# EAGLE design single_peg_board (EAGLE 9.3.0)
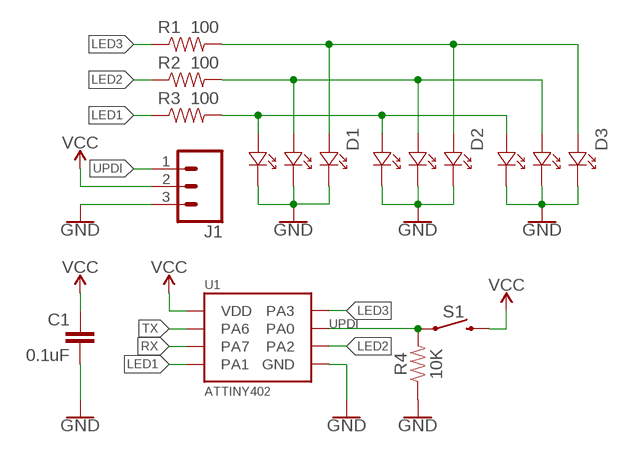
[diagram p0: schematic, sheet 1]

## Parts
C1  0.1uF  0.1UF-0603-25V-(+80/-20%)  [0603]
D1  19-337C/RSBHGHC-A88/4T  [6-SMD]
D2  19-337C/RSBHGHC-A88/4T  [6-SMD]
D3  19-337C/RSBHGHC-A88/4T  [6-SMD]
J1  CONN_03LONGPADS  [1X03_LONGPADS]
R1  100  100OHM-0603-1/4W-5%  [0603]
R2  100  100OHM-0603-1/4W-5%  [0603]
R3  100  100OHM-0603-1/4W-5%  [0603]
R4  10K  100OHM-0603-1/4W-5%  [0603]
S1  MOMENTARY-SWITCH-SPST-SMD-4.5MM-WINGED  [TACTILE_SWITCH_SMD_4.5MM_WINGED]
U1  ATTINY402  [8-SOIC]

## Nets
GND: C1.2 D1.P$1 D1.P$3 D1.P$5 D2.P$1 D2.P$3 D2.P$5 D3.P$1 D3.P$3 D3.P$5 J1.3 R4.1 U1.P$8(GND)
LED1: R3.1 U1.P$4(PA1)
LED2: R2.1 U1.P$5(PA2)
LED3: R1.1 U1.P$7(PA3)
N$13: D1.P$6 D2.P$6 D3.P$6 R3.2
N$14: D1.P$4 D2.P$4 D3.P$4 R2.2
N$15: D1.P$2 D2.P$2 D3.P$2 R1.2
RX: U1.P$3(PA7)
TX: U1.P$2(PA6)
UPDI: J1.1 R4.2 S1.2 S1.3 U1.P$6(PA0)
VCC: C1.1 J1.2 S1.1 S1.4 U1.P$1(VDD)

## Library data of the parts
C1 = SparkFun-Capacitors:0.1UF: 0.1µF ceramic capacitors A capacitor is a passive two-terminal electrical component used to store electrical energy temporarily in an electric field.; PROD_ID: CAP-00810
D1-D3 = IDEO-Diodes:19-337C/RSBHGHC-A88/4T
J1 = SparkFun-Connectors:CONN_03: Multi connection point. Often used as Generic Header-pin footprint for 0.1 inch spaced/style header connections On any of the 0.1 inch spaced packages, you can populate with these: Break Away Headers - Straight <https://www.sparkfun.com/products/116> (PRT-00116) Break Away Male Headers - Right Angle <https://www.sparkfun.com/products/553> (PRT-00553) Female Headers <https://www.sparkfun.com/products/115> (PRT-00115) Break Away Headers - Machine Pin <https://www.sparkfun.com/products/117> (PRT-00117) Break Away Female Headers - Swiss Machine Pin <https://www.sparkfun.com/products/743> (PRT-00743) Stackable Header - 3 Pin (Female, 0.1") <https://www.sparkfun.com/products/13875> (PRT-13875) For SCREWTERMINALS and SPRING TERMINALS visit here: Screw Terimnals on SparkFun.com <https://www.sparkfun.com/search/results?term=Screw+Terminals> (5mm/3.5mm/2.54mm spacing) This device is also useful as a general connection point to wire up your design to another part of your project. Our various solder wires solder well into these plated through hole pads. Hook-Up Wire - Assortment (Stranded, 22 AWG) <https://www.sparkfun.com/products/11375> (PRT-11375) Hook-Up Wire - Assortment (Solid Core, 22 AWG) <https://www.sparkfun.com/products/11367> (PRT-11367) View the entire wire category on our website here <https://www.sparkfun.com/categories/141> Special notes: Molex polarized connector foot print use with SKU : PRT-08232 with associated crimp pins and housings.
R1-R3 = SparkFun-Resistors:100OHM: 100Ω resistor A resistor is a passive two-terminal electrical component that implements electrical resistance as a circuit element. Resistors act to reduce current flow, and, at the same time, act to lower voltage levels within circuits. - Wikipedia; PROD_ID: RES-12438
R4 = SparkFun-Resistors:100OHM: 100Ω resistor A resistor is a passive two-terminal electrical component that implements electrical resistance as a circuit element. Resistors act to reduce current flow, and, at the same time, act to lower voltage levels within circuits. - Wikipedia; PROD_ID: RES-12438; VALUE: 100
S1 = SparkFun-Switches:MOMENTARY-SWITCH-SPST: Momentary Switch (Pushbutton) - SPST Normally-open (NO) SPST momentary switches (buttons, pushbuttons). Variants PTH-12MM - 12mm square, through-hole Momentary Pushbutton Switch - 12mm Square <https://www.sparkfun.com/products/9190> (COM-09190) PTH-6.0MM, PTH-6.0MM-KIT - 6.0mm square, through-hole Mini Pushbutton Switch <https://www.sparkfun.com/products/97> (COM-00097) KIT package intended for soldering kit's - only one side of pads' copper is exposed. PTH-RIGHT-ANGLE-KIT - Right-angle, through-hole Right Angle Tactile Button <https://www.sparkfun.com/products/10791> - Used on SparkFun BigTime Watch Kit <https://www.sparkfun.com/products/11734> SMD-12MM - 12mm square, surface-mount Tactile Button - SMD (12mm) <https://www.sparkfun.com/products/12993> (COM-12993) Used on SparkFun PicoBoard <https://www.sparkfun.com/products/11888> SMD-4.5MM - 4.5mm Square Trackball Switch Used on SparkFun Blackberry Trackballer Breakout <https://www.sparkfun.com/products/13169> SMD-4.6MMX2.8MM - 4.60mm x 2.80mm, surface mount Used on SparkFun SAMD21 Mini Breakout <https://www.sparkfun.com/products/13664> SMD-5.2MM, SMD-5.2-REDUNDANT - 5.2mm square, surface-mount Mini Pushbutton Switch - SMD <https://www.sparkfun.com/products/8720> (COM-08720) Used on Arduino Pro Mini <https://www.sparkfun.com/products/11114> REDUNDANT package connects both switch circuits together SMD-6.0X3.5MM - 6.0 x 3.5mm, surface mount Momentary Reset Switch SMD <https://www.sparkfun.com/products/8229> (COM-08229) SMD-6.2MM-TALL - 6.2mm square, surface mount Tactile Button - SMD (6mm) <https://www.sparkfun.com/products/12992> Used on SparkFun Digital Sandbox <https://www.sparkfun.com/products/12651> SMD-RIGHT-ANGLE - Right-angle, surface mount Used on SparkFun Block for Intel® Edison - Arduino <https://www.sparkfun.com/products/13036>
U1 = IDEO-ICs:ATTINY402

## Board
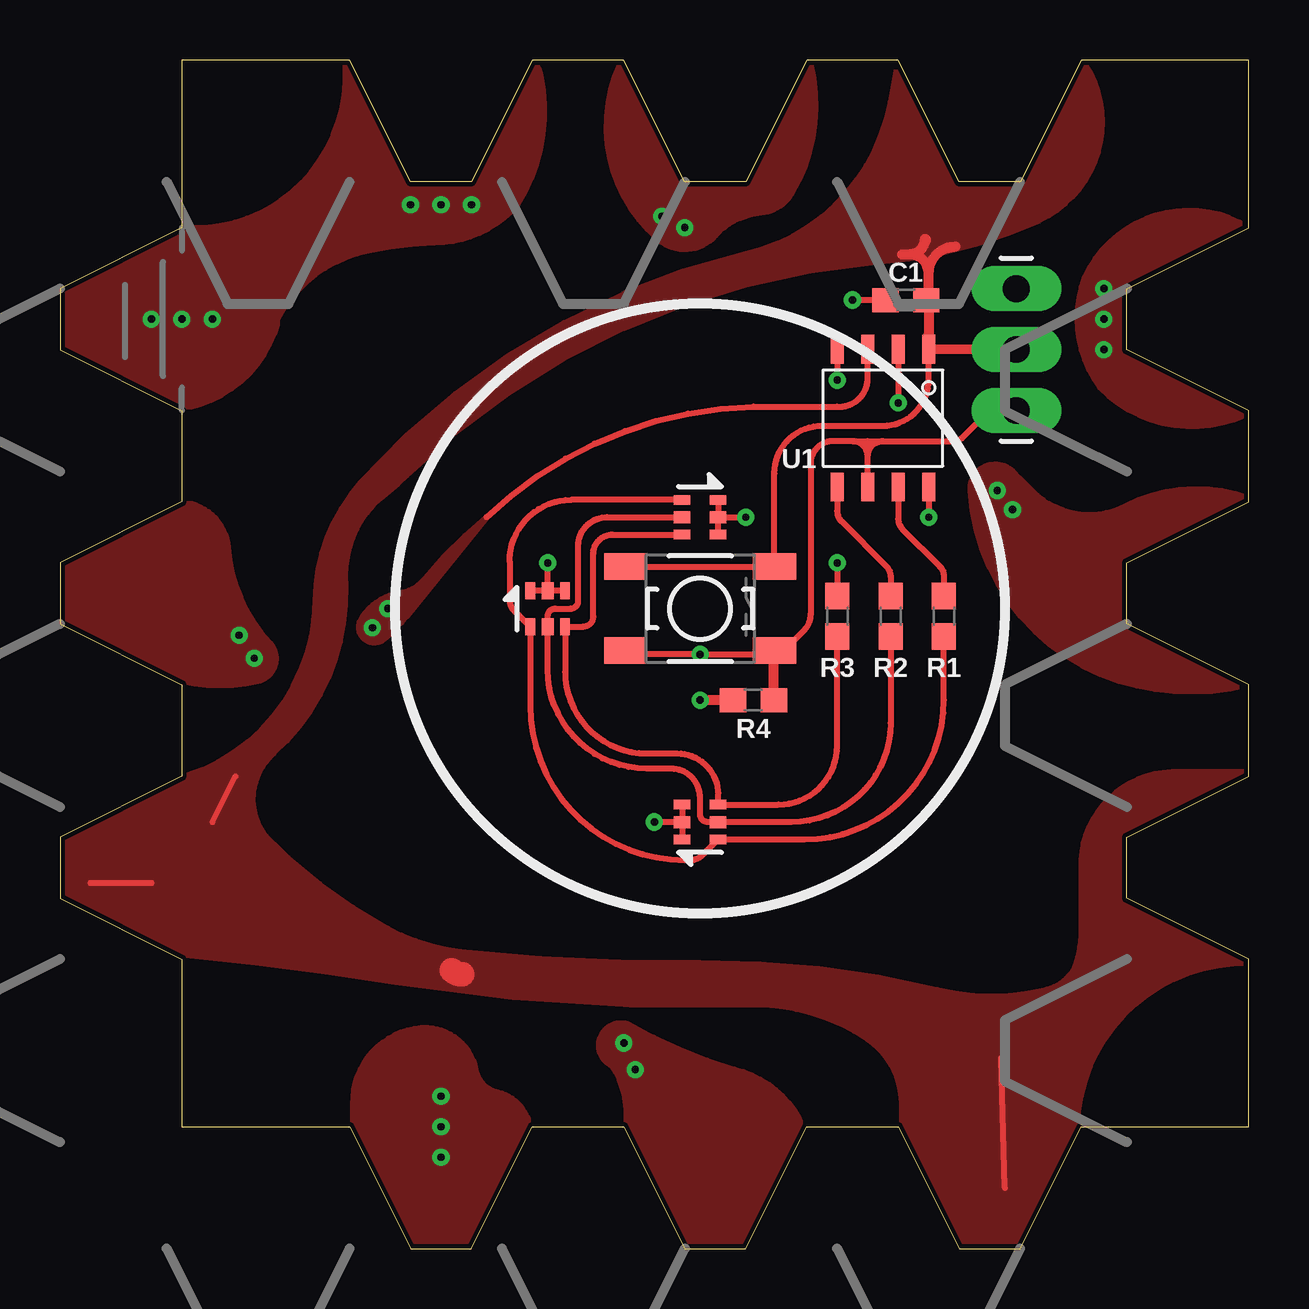
[diagram p1: board, top side]
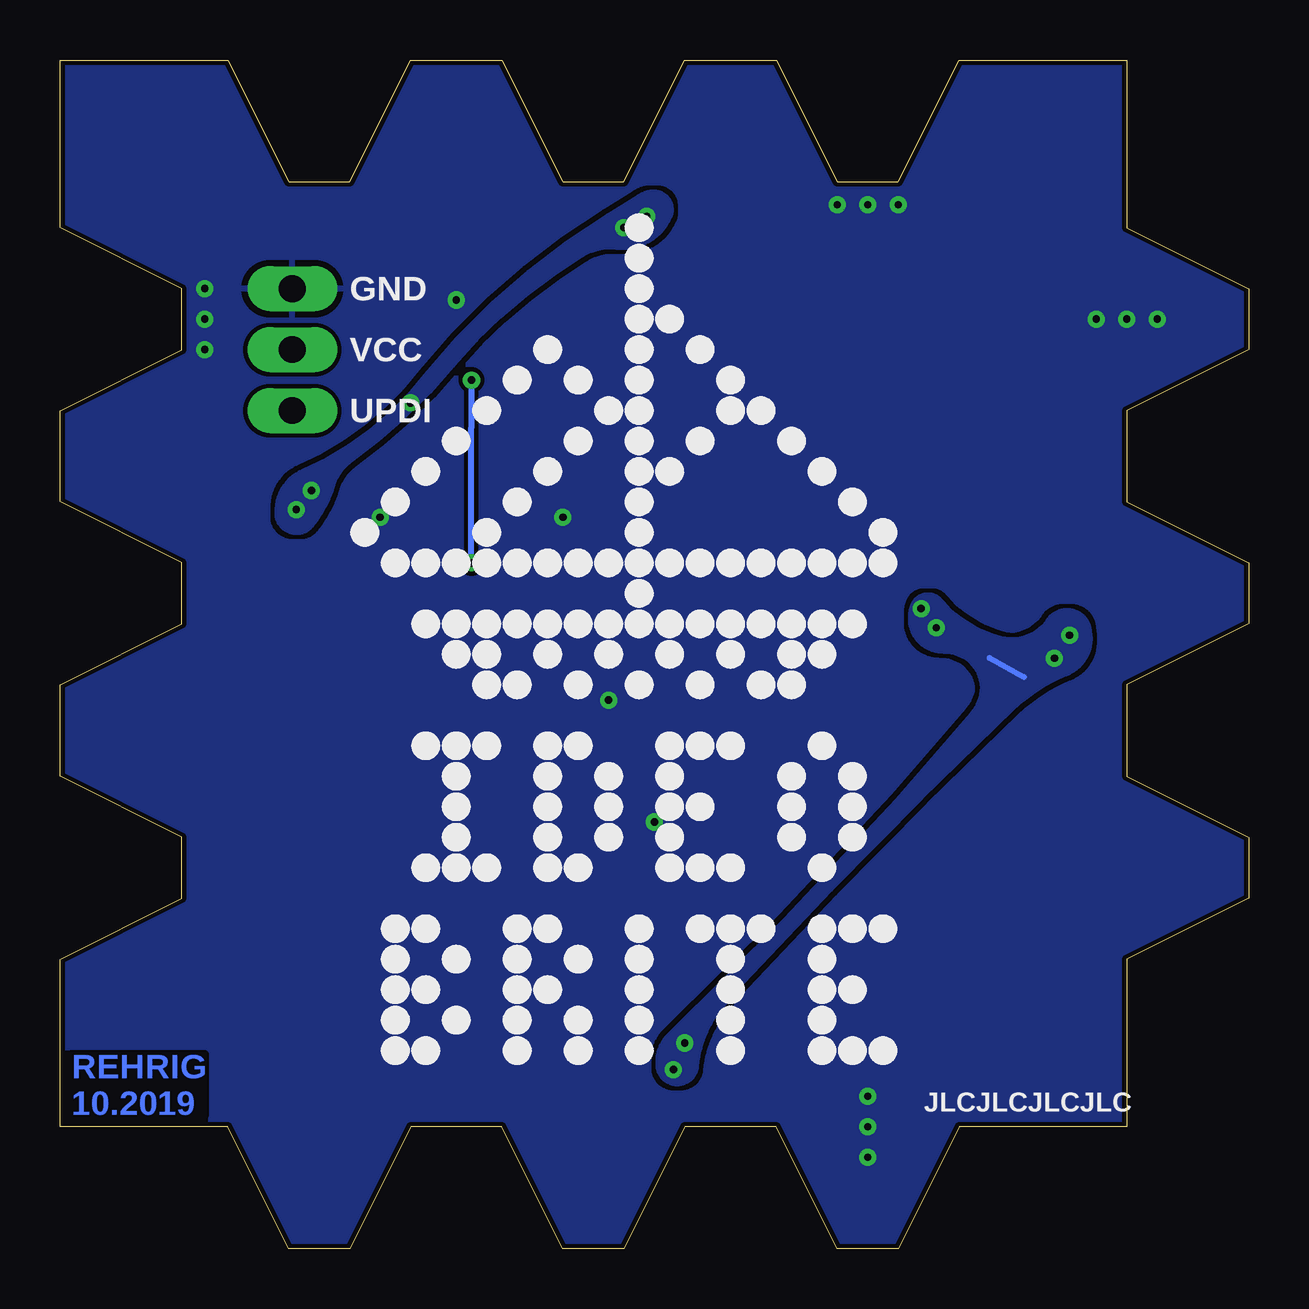
[diagram p2: board, bottom side, seen from below]

Size 49.53 x 49.53 mm. Coordinates in mm from the lower left corner, seen from the top.
Outline: 5.08,49.53 5.08,42.55 0,40.01 0,37.47 5.08,34.92 5.08,31.11 0,28.57 0,26.04 5.08,23.5 5.08,19.68 0,17.14 0,14.61 5.08,12.06 5.08,5.08 12.06,5.08 14.61,0 17.14,0 19.68,5.08 23.5,5.08 26.04,0 28.57,0 31.11,5.08 34.92,5.08 37.47,0 40.01,0 42.55,5.08 49.53,5.08 49.53,12.06 44.45,14.61 44.45,17.14 49.53,19.68 49.53,23.5 44.45,26.04 44.45,28.57 49.53,31.11 49.53,34.92 44.45,37.47 44.45,40.01 49.53,42.55 49.53,49.53 42.55,49.53 40.01,44.45 37.47,44.45 34.92,49.53 31.11,49.53 28.57,44.45 26.04,44.45 23.5,49.53 19.68,49.53 17.14,44.45 14.61,44.45 12.06,49.53 5.08,49.53
Copper layers (1*16): Top 0.035mm / dielectric 1.5mm / Bottom 0.035mm
Design rules "standard_rob *": minimum track width 7mil, minimum drill 12mil, track to track 7mil, track to pad 7mil, pad to pad 7mil, via to via 7mil, smd to smd 7mil, copper to edge 0.2mm, drill to drill 8mil, minimum pad ring 10mil, minimum via ring 8mil, stop-mask expansion 4mil, vias tented up to drill 12mil, thermal gap 10mil

### Footprints (pad centres in the part's own frame; a part is rotated, then mirrored left to right if it is on the bottom)
0603 = smd 1.1 x 1: 1 -0.85,0; 2 0.85,0
6-SMD = smd 0.7 x 0.4: P$1 0.75,0.725; P$2 -0.75,0.725; P$5 0.75,-0.725; P$6 -0.75,-0.725 | smd 0.7 x 0.5: P$3 0.75,0; P$4 -0.75,0
1X03_LONGPADS = drill 1.118 pad 1.88 long: 1 0,0; 2 2.54,0; 3 5.08,0
TACTILE_SWITCH_SMD_4.5MM_WINGED = smd 1.8 x 1.1: 1 3.1,1.75; 2 3.1,-1.75; 3 -3.1,-1.75; 4 -3.1,1.75
8-SOIC = smd 0.55 x 1.2: P$1 -1.905,-2.87; P$2 -0.635,-2.87; P$3 0.635,-2.87; P$4 1.905,-2.87; P$5 1.905,2.87; P$6 0.635,2.87; P$7 -0.635,2.87; P$8 -1.905,2.87

### Placement (x,y rotation side)
C1  35.24,39.53 180 top
D1  26.67,30.48 0 top
D2  20.32,26.67 90 top
D3  26.67,17.78 180 top
J1  39.85,34.92 90 top
R1  36.83,26.35 270 top
R2  34.61,26.35 270 top
R3  32.38,26.35 270 top
R4  28.89,22.86 0 top
S1  26.67,26.67 0 top
U1  34.29,34.61 180 top

### Tracks (layer width: path | path; a pad name or v marks a point on that pad's centre or on a via)
GND  (via drill 0.3)
  Top 0.254: U1.P$8 v36.2,30.48 | D2.P$5 D2.P$3 | D2.P$3 D2.P$1 | D2.P$3 v20.32,28.57 | D1.P$1 D1.P$3 | D1.P$5 D1.P$3 | D1.P$3 v28.57,30.48 | D3.P$5 D3.P$3 | D3.P$3 D3.P$1 | D3.P$3 v24.77,17.78 | C1.2 v33.02,39.53
  Top 0.406: R4.1 v26.67,22.86
  other vias: 6.35,38.73 5.08,38.73 3.81,38.73 15.88,6.35 15.88,5.08 15.88,3.81 43.5,40.01 43.5,38.73 43.5,37.47 17.14,43.5 15.88,43.5 14.61,43.5
  pour Bottom (rank 2): 0,0 0,49.53 49.53,49.53 49.53,0
  pour Top: 5.08,42.55 5.71,42.55 arc35 9.21,43.66 arc58 11.91,49.21 arc-96 12.86,50.16 arc6 18.26,50.16 arc-88 20,48.9 arc-44 19.05,43.5 arc-49 15.56,41.91 arc10 12.86,41.59 arc51 9.05,38.73 arc26 9.05,38.58 arc-114 1.27,36.04 arc8 -0.16,36.99 arc-141 -0.32,40.64 arc-5
  pour Top: 12.22,5.08 12.22,6.03 arc-87 15.08,9.21 arc-82 17.3,7.46 arc69 18.26,6.51 arc-62 19.53,5.24 arc-51 18.73,-1.59 arc-122 12.7,-1.11 arc-37 12.06,4.92 arc25
  pour Top: 49.53,42.55 arc96 42.7,40.48 arc57 43.34,35.88 arc86 50.64,35.56 arc115
LED1  (via drill 0.3)
  Top 0.254: U1.P$4 v32.38,36.2 | v32.38,28.57 R3.1
  Bottom 0.254: v32.38,36.2 32.38,34.29 32.38,34.23 v32.38,28.57
LED2
  Top 0.254: U1.P$5 32.38,30.73 arc45 32.56,30.3 34.43,28.44 arc-45 34.61,28 R2.1
LED3
  Top 0.254: U1.P$7 34.92,30.41 arc45 35.1,29.98 36.65,28.44 arc-45 36.83,28 R1.1
N$13
  Top 0.254: D1.P$6 23.02,29.75 arc90 22.23,28.96 22.23,26.35 arc-90 21.79,25.92 D2.P$6 21.05,24.04 arc90 24.45,20.64 25.72,20.64 arc-90 27.42,18.93 D3.P$6 29.93,18.5 arc90 32.38,20.95 R3.2
N$14
  Top 0.254: D1.P$4 22.8,30.48 arc90 21.59,29.27 21.59,26.99 arc-90 21.27,26.67 20.64,26.67 arc90 20.32,26.35 D2.P$4 20.32,24.13 arc90 24.45,20 25.46,20 arc-90 26.67,18.8 26.67,18.1 arc90 26.99,17.78 D3.P$4 30.48,17.78 arc90 34.61,21.91 R2.2
N$15
  Top 0.254: D1.P$2 21.3,31.2 arc90 18.73,28.64 18.73,27.04 arc45 18.91,26.6 D2.P$2 19.59,22.63 arc90 26.04,16.19 26.3,16.19 arc45 26.74,16.37 D3.P$2 31.02,17.05 arc90 36.83,22.86 R1.2
RX  (via drill 0.3)
  Top 0.254: 17.78,30.48 arc-42 28.89,35.08 32.38,35.08 arc90 33.66,36.2 U1.P$3
  Bottom 0.254: 9.37,23.81 10.79,24.61
  other vias: 23.97,7.46 23.5,8.57 8.1,24.61 7.46,25.56 13.02,25.88 13.65,26.67
  pour Top: 23.18,3.49 23.34,4.29 arc57 23.02,7.62 arc-173 23.65,9.37 arc13 28.1,7.46 arc-54 30.96,5.08 arc-47 30.96,-2.38 arc-136 24.45,-2.22 arc-29
  pour Top: 3.97,31.11 4.92,31.11 arc-85 6.99,29.21 arc38 8.73,25.24 arc-119 8.26,23.65 arc-27 5.08,23.65 arc11 -2.7,24.77 arc-161 -3.17,28.73 arc4
  pour Bottom: 9.37,24.77 10.16,23.81 arc7 24.13,8.89 arc-52 24.61,7.62 arc-169 23.02,7.62 arc33 22.07,10 arc5 21.11,11.11 arc3 9.84,22.54 arc22 7.62,23.97 arc-83 6.67,25.88 arc-139 8.41,26.04
  pour Bottom: 8.26,26.19 8.57,25.88 arc59 10.32,25.4 arc35 12.86,26.99 arc-115 13.97,26.83 arc-116 12.7,24.92 arc130 11.43,22.38 arc-33 11.75,21.59 arc-190 11.27,21.59 arc88 10.64,22.38 arc-75 9.53,23.5 arc52 8.89,24.45 arc-52 7.94,25.88 arc-105
  pour Top: 17.78,30.48 14.45,26.35 arc-12 13.49,25.4 arc-157 12.54,26.19 arc-53 14.13,27.3 arc42 15.24,27.94 arc-12
TX  (via drill 0.3)
  Top 0.254: U1.P$2 v34.92,35.24
  other vias: 39.69,30.8 39.05,31.59 25.08,43.02 26.04,42.55
  pour Top: 24.29,51.44 23.34,49.37 arc74 24.92,42.07 arc89 27.3,42.23 arc-44 29.21,43.18 arc54 30.48,43.97 arc45 31.27,49.37 arc9 30.8,50.8 arc123
  pour Bottom: 25.4,43.81 26.67,43.02 arc-20 34.29,36.35 arc29 39.37,32.38 arc-70 40.48,30.64 arc-138 39.05,30.16 arc-20 38.26,31.59 arc36 37.47,32.86 arc-15 33.18,36.83 arc18 27.78,41.43 arc39 26.35,41.75 arc-74 24.13,43.02 arc-100 24.61,43.97 arc-50
  pour Top: 52.07,24.13 49.53,23.5 arc-31 44.13,23.65 arc-69 37.94,31.59 arc-138 39.69,32.38 arc-1 40.48,31.59 arc73 44.45,30.96 arc-48 49.53,31.27 arc-100
UPDI  (via drill 0.3)
  Top 0.254: S1.3 arc-45 23.2,24.77 v26.67,24.77 29.4,24.77 arc45 S1.2 29.93,24.92 arc45 30.32,25.08 30.98,25.74 arc45 31.27,26.45 31.27,32.7 arc-90 32.23,33.66 33.02,33.66 | 33.66,33.02 arc90 33.02,33.66 | 33.66,33.02 U1.P$6 33.66,33.66 | 33.66,33.02 arc-90 34.29,33.66 | 34.29,33.66 37.21,33.66 arc45 37.64,33.83 38.73,34.92 J1.1 | 33.02,33.66 33.66,33.66 | 33.66,33.66 34.29,33.66
  Top 0.406: R4.2 29.74,24.89 arc-90 S1.2
VCC
  Top 0.254: S1.4 S1.1 29.77,32.31 arc-90 31.75,34.29 34.29,34.29 arc90 36.2,36.2 U1.P$1 | 39.37,2.54 39.21,7.94 | 1.27,15.24 3.81,15.24 | 6.35,17.78 7.3,19.68 | C1.1 36.2,39.76
  Top 0.406: J1.2 U1.P$1 36.2,38.1 36.2,39.76 36.2,40.64 | 35.08,41.43 35.4,41.43 | 35.4,41.43 arc90 36.04,42.07 arc-90 36.09,42.01 | 36.2,40.64 arc90 35.4,41.43 | 36.2,40.64 arc-90 37.31,41.75
  Top 1.016: 16.76,11.43 arc-45 16.33,11.61
  pour Top: 5.08,19.68 -0.64,17.46 -0.64,14.29 5.08,12.06 8.89,15.88
  pour Top: 42.39,5.08 arc-90 49.53,11.91 49.53,19.84 46.67,19.84 arc90 42.55,16.19 42.55,13.02 arc-90 37.62,8.57 arc90 35.24,4.13 35.24,-0.79 42.23,-0.79
  pour Top: 35.08,5.24 35.08,6.03 arc56 33.66,8.73 arc36 28.73,10.16 arc-11 13.97,11.11 arc4 5.24,12.22 arc-169 5.24,19.53 arc-56 7.14,18.73 arc22 13.65,13.34 arc23 16.67,12.38 arc7 26.67,11.91 arc-14 36.51,10.79 arc27 41.12,10.79 arc55 42.39,11.91 arc-209 44.13,10.64 arc16 40.48,6.67 arc-81
  pour Top: 34.92,49.53 34.61,47.78 arc-66 28.57,41.43 arc35 12.54,31.91 arc41 10.64,26.99 arc-72 5.24,19.68 arc152 5.4,17.3 arc-17 8.26,16.35 arc160 8.73,16.99 arc-91 8.89,20.64 arc50 11.91,27.62 arc-54 13.34,31.27 arc6 14.45,32.23 arc-39 33.97,41.12 arc20 40.8,42.86 arc98 42.7,49.37 arc109 35.08,49.69 arc-15

### Text on the board
Bottom: REHRIG / 10.2019
bPlace: GND | VCC | UPDI | JLCJLCJLCJLC